# EAGLE design tinyduino-breakout-mk-2.1 (EAGLE 6.5.0)
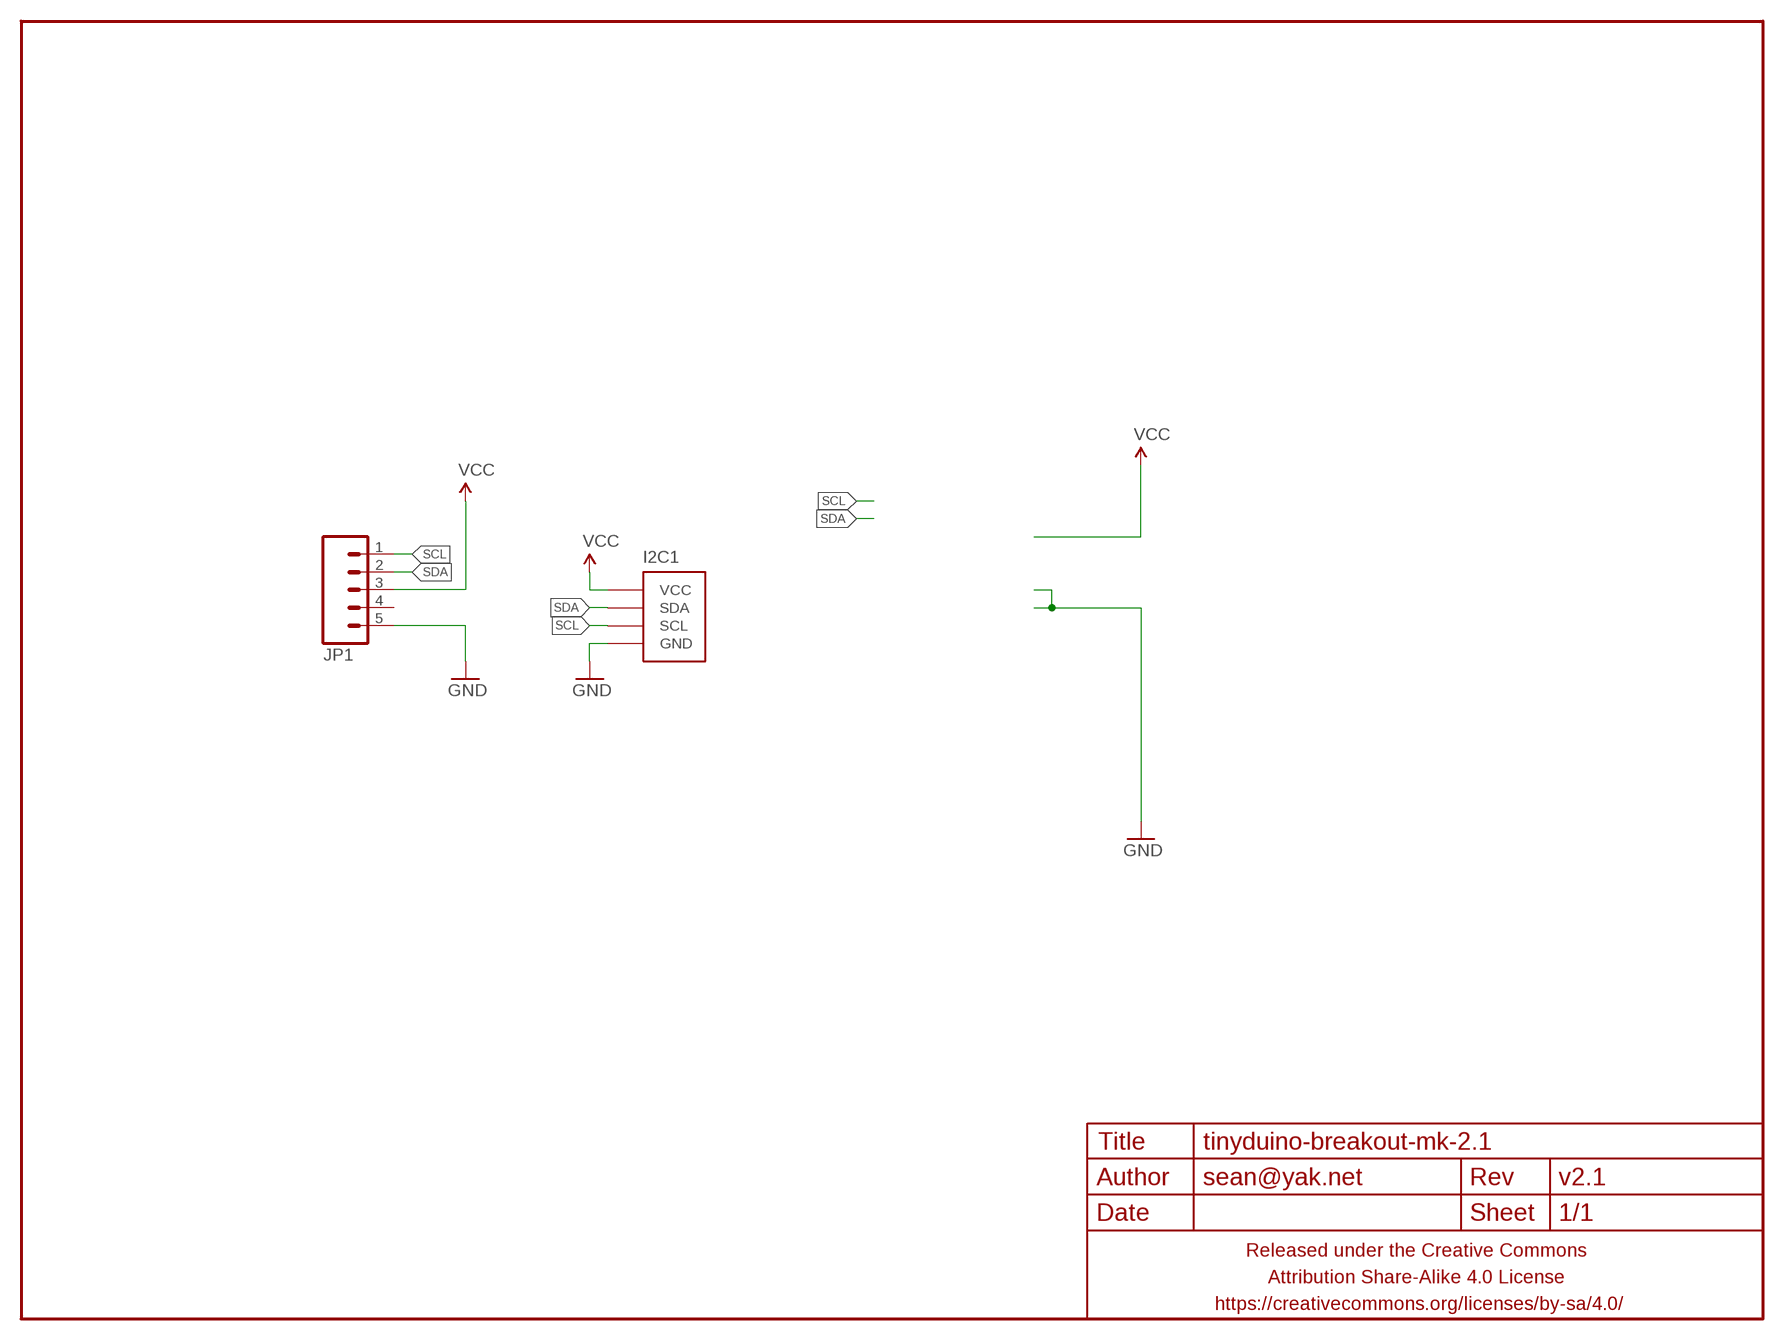
[diagram p0: schematic, sheet 1]

## Parts
FRAME1  FRAME-LETTERNO_PACKAGE  [DUMMY]
I2C1  M04-I2CTINDUINO-CONNECTOR-REV  [DF12-32-DP-I2CONLY]
JP1  M05SMD-SHORT  [1X05-SMD-SHORT]

## Nets
GND: I2C1.11(GND) I2C1.13(GND) JP1.5
SCL: JP1.1
SDA: JP1.2
VCC: I2C1.5(VCC) JP1.3
Unconnected: I2C1.2(SCL) I2C1.4(SDA) JP1.4

## Library data of the parts
FRAME1 = A_butts:FRAME-LETTER: Schematic Frame Standard 8.5x11 US Letter frame; DESIGNER: sean@yak.net; VERSION: v2.1
I2C1 = A_butts:M04-I2C
JP1 = A_butts:M05: Header 5 Standard 5-pin 0.1" header. Use with straight break away headers (SKU : PRT-00116), right angle break away headers (PRT-00553), swiss pins (PRT-00743), machine pins (PRT-00117), and female headers (PRT-00115). Molex polarized connector foot print use with SKU : PRT-08230 with associated crimp pins and housings.

## Board
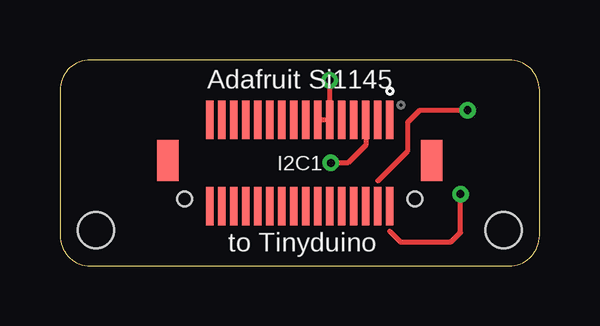
[diagram p1: board, top side]
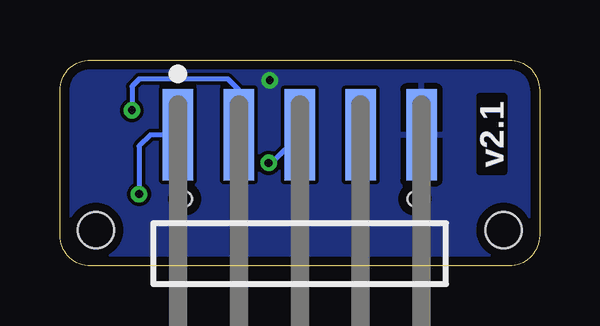
[diagram p2: board, bottom side, seen from below]

Size 20 x 8.6 mm. Coordinates in mm from the lower left corner, seen from the top.
Outline: 20,1.27 20,7.33 arc90 18.73,8.6 1.27,8.6 arc90 0,7.33 0,1.27 arc90 1.27,0 18.73,0 arc90 20,1.27
Copper layers (1*16): Top 0.0356mm / dielectric 1.5011mm / Bottom 0.0356mm
Design rules "LaenPCBOrder_2": minimum track width 6mil, minimum drill 13mil, track to track 6mil, track to pad 6mil, pad to pad 6mil, via to via 6mil, smd to smd 6mil, copper to edge 15mil, drill to drill 6mil, minimum pad ring 7mil, minimum via ring 7mil, stop-mask expansion 3mil, vias tented up to drill 20mil, thermal gap 10mil
Holes 1.5 mm at 1.5,1.5 18.5,1.5

### Footprints (pad centres in the part's own frame; a part is rotated, then mirrored left to right if it is on the bottom)
DF12-32-DP-I2CONLY = smd 0.3 x 1.6: 1 -3.75,-1.8; 2 -3.75,1.8; 3 -3.25,-1.8; 4 -3.25,1.8; 5 -2.75,-1.8; 6 -2.75,1.8; 7 -2.25,-1.8; 8 -2.25,1.8; 9 -1.75,-1.8; 10 -1.75,1.8; 11 -1.25,-1.8; 12 -1.25,1.8; 13 -0.75,-1.8; 14 -0.75,1.8; 15 -0.25,-1.8; 16 -0.25,1.8; 17 0.25,-1.8; 18 0.25,1.8; 19 0.75,-1.8; 20 0.75,1.8; 21 1.25,-1.8; 22 1.25,1.8; 23 1.75,-1.8; 24 1.75,1.8; 25 2.25,-1.8; 26 2.25,1.8; 27 2.75,-1.8; 28 2.75,1.8; 29 3.25,-1.8; 30 3.25,1.8; 31 3.75,-1.8; 32 3.75,1.8 | smd 0.9 x 1.7: F1 -5.5,-0.1; F2 5.5,-0.1 | hole 0.6: -4.8,1.5; 4.8,1.5
1X05-SMD-SHORT = smd 1.27 x 3.81: 1 -5.08,3.175; 2 -2.54,3.175; 3 0,3.175; 4 2.54,3.175; 5 5.08,3.175

### Placement (x,y rotation side)
FRAME1  0,0 0 top
I2C1  10,4.3 180 top
JP1  10,2.3 0 bottom

### Tracks (layer width: path | path; a pad name or v marks a point on that pad's centre or on a via)
GND  (via drill 0.33)
  Top 0.2: v11.25,7.75 I2C1.11 I2C1.13
  pour Bottom: 1.27,8.6 18.73,8.6 arc-90 20,7.33 20,1.27 arc-90 18.73,0 1.27,0 arc-90 0,1.27 0,7.33 arc-90
SCL  (via drill 0.33)
  Top 0.2: 13.75,1.45 14.2,1 16.3,1 16.7,1.4 v16.7,3
  Bottom 0.2: JP1.1 16.23,5.47 16.7,5 v16.7,3
SDA  (via drill 0.33)
  Top 0.2: 13.25,3.55 14.5,4.8 14.5,6 15,6.5 v17,6.5
  Bottom 0.2: JP1.2 12.54,7.34 13,7.8 16.7,7.8 17,7.5 v17,6.5
VCC  (via drill 0.33)
  Top 0.2: I2C1.5 12.75,5.05 12,4.3 v11.3,4.3
  Bottom 0.2: v11.3,4.3 11.18,4.3 JP1.3

### Text on the board
tPlace: Adafruit Si1145 | to Tinyduino